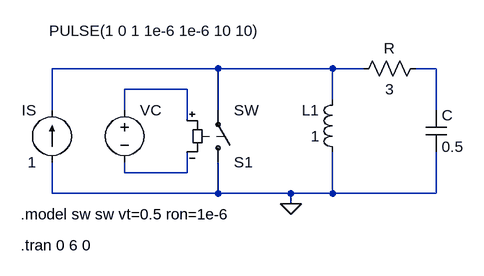
[diagram p0: schematic assig4_q2.asc]
assig4_q2.asc, the LTspice schematic file:
Version 4
SHEET 1 880 680
WIRE 240 80 -16 80
WIRE 416 80 240 80
WIRE 464 80 416 80
WIRE 576 80 544 80
WIRE 192 112 96 112
WIRE 416 128 416 80
WIRE -16 144 -16 80
WIRE 96 144 96 112
WIRE 240 144 240 80
WIRE 576 144 576 80
WIRE 192 160 192 112
WIRE 96 240 96 224
WIRE 192 240 192 208
WIRE 192 240 96 240
WIRE -16 272 -16 224
WIRE 240 272 240 224
WIRE 240 272 -16 272
WIRE 352 272 240 272
WIRE 416 272 416 208
WIRE 416 272 352 272
WIRE 576 272 576 208
WIRE 576 272 416 272
WIRE 352 288 352 272
FLAG 352 288 0
SYMBOL res 560 64 R90
WINDOW 0 0 56 VBottom 2
WINDOW 3 32 56 VTop 2
SYMATTR InstName R
SYMATTR Value 3
SYMBOL voltage 96 128 R0
WINDOW 3 -116 -106 Left 2
WINDOW 123 0 0 Left 0
WINDOW 39 0 0 Left 0
SYMATTR Value PULSE(1 0 1 1e-6 1e-6 10 10)
SYMATTR InstName VC
SYMBOL ind 432 224 R180
WINDOW 0 36 80 Left 2
WINDOW 3 36 40 Left 2
SYMATTR InstName L1
SYMATTR Value 1
SYMBOL cap 560 144 R0
SYMATTR InstName C
SYMATTR Value 0.5
SYMBOL sw 240 240 M180
SYMATTR InstName S1
SYMBOL current -16 224 R180
WINDOW 0 24 80 Left 2
WINDOW 3 24 0 Left 2
SYMATTR InstName IS
SYMATTR Value 1
TEXT -64 304 Left 2 !.model sw sw vt=0.5 ron=1e-6
TEXT -64 352 Left 2 !.tran 0 6 0

The netlist it stands for:
* assig4_q2.asc
R N002 N001 3
VC N003 N004 PULSE(1 0 1 1e-6 1e-6 10 10)
L1 0 N001 1
C N002 0 0.5
S1 0 N001 N003 N004 SW
IS 0 N001 1
.model sw sw vt=0.5 ron=1e-6
.tran 0 6 0
.backanno
.end